# Altium schematic sheet sema.SchDoc
size A4
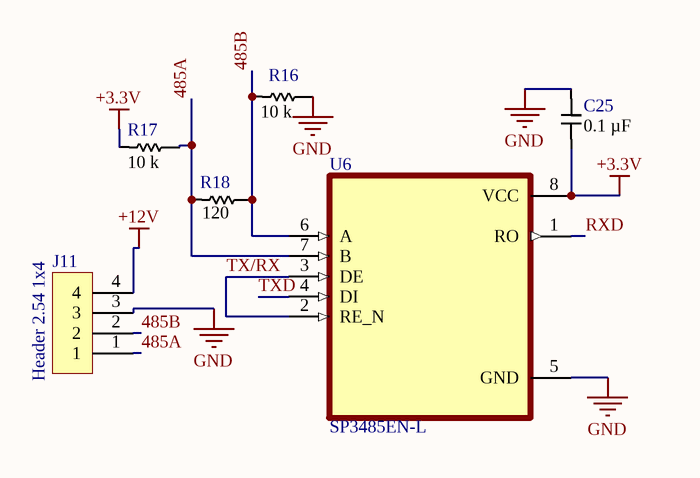
[diagram p0: sema.SchDoc]

## Parts
C25  Capacitance: 0.1 µF  [SAMSUNG_CAP_0805_095]  (hidden comment: 0.1uF)
J11  Header 2.54 1x4  [Header 2.54 1x4]
R16  Resistance: 10 k  [ROYALOHM_RES_0805]  (hidden comment: 10k)
R17  Resistance: 10 k  [ROYALOHM_RES_0805]  (hidden comment: 10k)
R18  Resistance: 120  [ROYALOHM_RES_0805]  (hidden comment: 0805S8F1000T5E)
U6  SP3485EN-L  [SOIC127P600X175-8N]

## Nets
+3.3V: C25.1 R17.1 U6.8(VCC)
+12V: J11.4
GND: C25.2 J11.3 R16.2 U6.5(GND)
485A: J11.1 R17.2 R18.1 U6.7(B)
485B: J11.2 R16.1 R18.2 U6.6(A)
RXD: U6.1(RO)
TX/RX: U6.2(RE_N) U6.3(DE)
TXD: U6.4(DI)

## Library data of the parts
C25 = 0.1uF: CAP CER 0.1UF 25V X7R 0805; Supplier 1: Digi-Key; Supplier 2: Farnell; Supplier 3: Mouser; Supplier Part Number 1: 1276-1099-1-ND; Supplier Part Number 2: 3013475; Supplier Part Number 3: 187-CL21B104KACNNNC
R16 R17 = 10k: RES SMD 10K OHM 1% 1/8W 0805
R18 = 0805S8F1000T5E: RES SMD 100R OHM 1% 1/8W 0805
U6 = SP3485EN-L: MF: {'manufacturer': u'MaxLinear, Inc.'}; Price: None; Value: *; Package: None; Availability: Unavailable; MP: SP3485EN-L